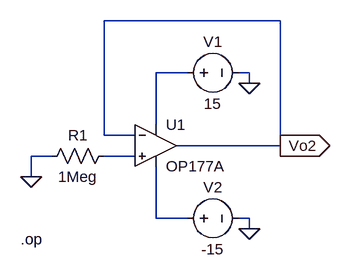
[diagram p0: schematic Run_2_A.asc]
Run_2_A.asc, the LTspice schematic file:
Version 4
SHEET 1 880 680
WIRE 448 -16 176 -16
WIRE 304 64 256 64
WIRE 400 64 384 64
WIRE 400 80 400 64
WIRE 256 144 256 64
WIRE 176 160 176 -16
WIRE 224 160 176 160
WIRE 448 176 448 -16
WIRE 448 176 288 176
WIRE 96 192 64 192
WIRE 224 192 176 192
WIRE 64 224 64 192
WIRE 256 288 256 208
WIRE 304 288 256 288
WIRE 400 288 384 288
WIRE 400 304 400 288
FLAG 400 80 0
FLAG 400 304 0
FLAG 448 176 Vo2
IOPIN 448 176 Out
FLAG 64 224 0
SYMBOL OpAmps\\OP177A 256 112 R0
SYMATTR InstName U1
SYMBOL voltage 288 64 R270
WINDOW 0 32 56 VTop 2
WINDOW 3 -32 56 VBottom 2
WINDOW 123 0 0 Left 0
WINDOW 39 0 0 Left 0
SYMATTR InstName V1
SYMATTR Value 15
SYMBOL voltage 288 288 R270
WINDOW 0 32 56 VTop 2
WINDOW 3 -32 56 VBottom 2
WINDOW 123 0 0 Left 0
WINDOW 39 0 0 Left 0
SYMATTR InstName V2
SYMATTR Value -15
SYMBOL res 192 176 R90
WINDOW 0 0 56 VBottom 2
WINDOW 3 32 56 VTop 2
SYMATTR InstName R1
SYMATTR Value 1Meg
TEXT 48 320 Left 2 !.op

The netlist it stands for:
* Run_2_A.asc
XU1 N002 Vo2 N001 N003 Vo2 OP177A  ; pins In+ In- V+ V- OUT
V1 N001 0 15
V2 N003 0 -15
R1 N002 0 1Meg
.op
.backanno
.end